# Altium schematic sheet Sheet1.SchDoc
size A4
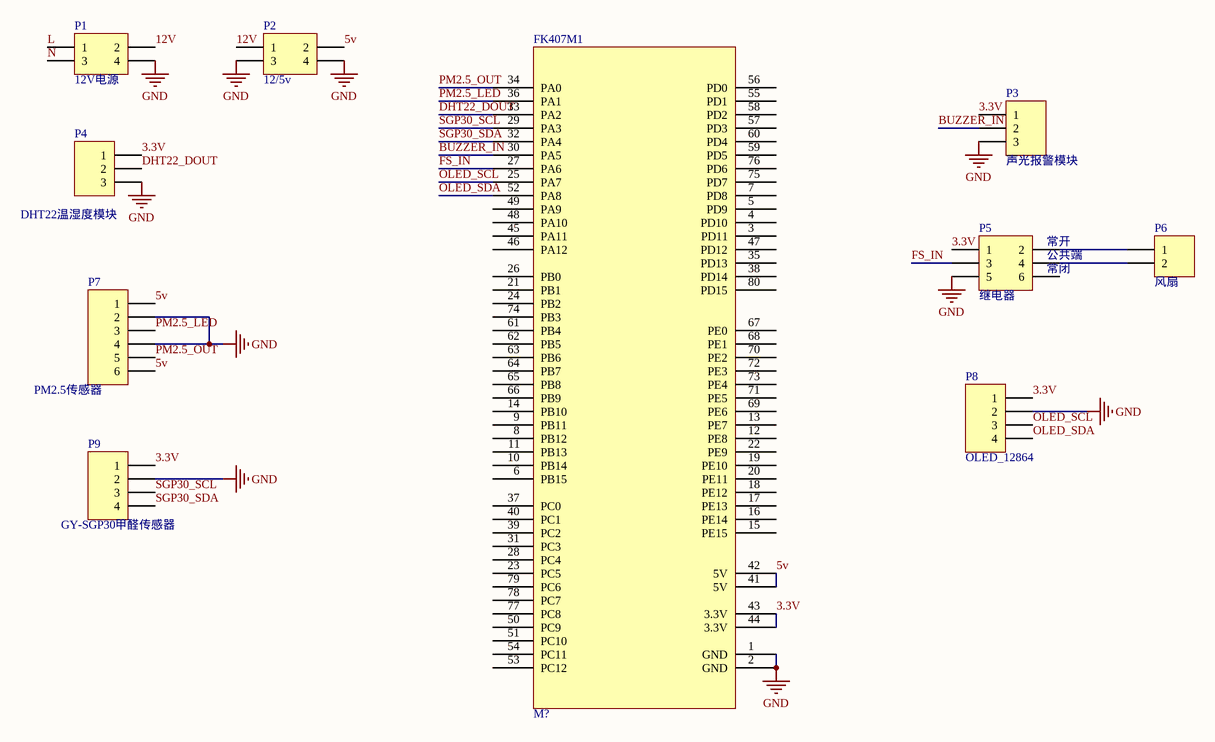
[diagram p0: Sheet1.SchDoc]

## Parts
FK407M1  M?  [FK407M1]
P1  12V电源  [HDR2X2]
P2  12/5v  [HDR2X2]
P3  声光报警模块  [HDR1X3]
P4  DHT22温湿度模块  [HDR1X3]
P5  继电器  [HDR2X3]
P6  风扇  [HDR1X2]
P7  PM2.5传感器  [HDR1X6]
P8  OLED_12864  [HDR1X4]
P9  GY-SGP30甲醛传感器  [HDR1X4]

## Nets
GND: FK407M1.1(GND) FK407M1.2(GND) P1.4 P2.3 P2.4 P3.3 P4.3 P5.5 P7.2 P7.4 P8.2 P9.2
3.3V: FK407M1.43(3.3V) FK407M1.44(3.3V) P3.1 P4.1 P5.1 P8.1 P9.1
5v: FK407M1.41(5V) FK407M1.42(5V) P2.2 P7.1 P7.6
12V: P1.2 P2.1
BUZZER_IN: FK407M1.30(PA5) P3.2
DHT22_DOUT: FK407M1.33(PA2) P4.2
FS_IN: FK407M1.27(PA6) P5.3
L: P1.1
N: P1.3
OLED_SCL: FK407M1.25(PA7) P8.3
OLED_SDA: FK407M1.52(PA8) P8.4
PM2.5_LED: FK407M1.36(PA1) P7.3
PM2.5_OUT: FK407M1.34(PA0) P7.5
SGP30_SCL: FK407M1.29(PA3) P9.3
SGP30_SDA: FK407M1.32(PA4) P9.4
NetP5_2: P5.2 P6.1
NetP5_4: P5.4 P6.2

Not connected (* = marked no-connect by the designer): FK407M1 3(PD11) 4(PD10) 5(PD9) 6(PB15) 7(PD8) 8(PB12) 9(PB11) 10(PB14) 11(PB13) 12(PE8) 13(PE7) 14(PB10) 15(PE15) 16(PE14) 17(PE13) 18(PE12) 19(PE10) 20(PE11) 21(PB1) 22(PE9) 23(PC5) 24(PB2) 26(PB0) 28(PC4) 31(PC3) 35(PD13) 37(PC0) 38(PD14) 39(PC2) 40(PC1) 45(PA11) 46(PA12) 47(PD12) 48(PA10) 49(PA9) 50(PC9) 51(PC10) 53(PC12) 54(PC11) 55(PD1) 56(PD0) 57(PD3) 58(PD2) 59(PD5) 60(PD4) 61(PB4) 62(PB5) 63(PB6) 64(PB7) 65(PB8) 66(PB9) 67(PE0) 68(PE1) 69(PE6) 70(PE2) 71(PE5) 72(PE3) 73(PE4) 74(PB3) 75(PD7) 76(PD6) 77(PC8) 78(PC7) 79(PC6) 80(PD15); P5 6

## Notes on the sheet
- (near P5) 公共端
- (near P5) 常开
- (near P5) 常闭

## Library data of the parts
FK407M1 = FK407M1
P1 P2 = Header 2X2: Header, 2-Pin, Dual row; LatestRevisionDate: 17-Jul-2002; LatestRevisionNote: Re-released for DXP Platform.; Publisher: Altium Limited
P3 P4 = Header 3: Header, 3-Pin; LatestRevisionDate: 17-Jul-2002; LatestRevisionNote: Re-released for DXP Platform.; Publisher: Altium Limited
P5 = Header 3X2: Header, 3-Pin, Dual row; LatestRevisionDate: 17-Jul-2002; LatestRevisionNote: Re-released for DXP Platform.; Publisher: Altium Limited
P6 = Header 2: Header, 2-Pin; LatestRevisionDate: 17-Jul-2002; LatestRevisionNote: Re-released for DXP Platform.; Publisher: Altium Limited
P7 = Header 6: Header, 6-Pin; LatestRevisionDate: 17-Jul-2002; LatestRevisionNote: Re-released for DXP Platform.; Publisher: Altium Limited
P8 P9 = Header 4: Header, 4-Pin; LatestRevisionDate: 17-Jul-2002; LatestRevisionNote: Re-released for DXP Platform.; Publisher: Altium Limited